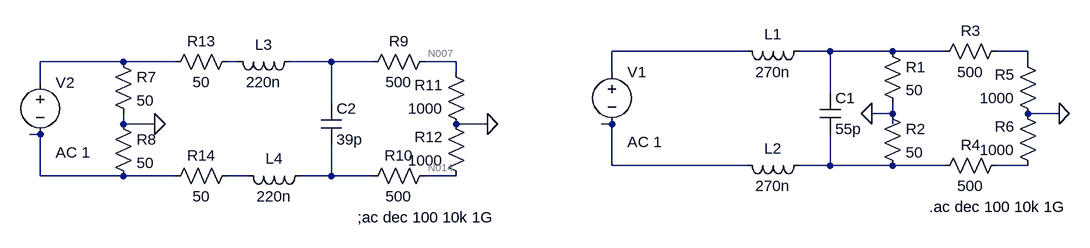
[diagram p0: schematic Filtre DAC.asc]
Filtre DAC.asc, the LTspice schematic file:
Version 4
SHEET 1 880 680
WIRE 304 112 96 112
WIRE 432 112 384 112
WIRE 528 112 432 112
WIRE 608 112 528 112
WIRE 736 112 688 112
WIRE -656 128 -784 128
WIRE -576 128 -656 128
WIRE -480 128 -496 128
WIRE -336 128 -400 128
WIRE -272 128 -336 128
WIRE -144 128 -192 128
WIRE 736 128 736 112
WIRE -144 144 -144 128
WIRE 96 144 96 112
WIRE -784 160 -784 128
WIRE 432 176 432 112
WIRE -336 192 -336 128
WIRE 528 208 528 192
WIRE 528 208 496 208
WIRE 784 208 736 208
WIRE -656 224 -656 208
WIRE -608 224 -656 224
WIRE -96 224 -144 224
WIRE 96 224 80 224
WIRE 528 224 528 208
WIRE -784 240 -800 240
WIRE 96 288 96 224
WIRE 304 288 96 288
WIRE 432 288 432 240
WIRE 432 288 384 288
WIRE 528 288 432 288
WIRE 608 288 528 288
WIRE 736 288 688 288
WIRE -784 304 -784 240
WIRE -656 304 -784 304
WIRE -576 304 -656 304
WIRE -464 304 -496 304
WIRE -336 304 -336 256
WIRE -336 304 -384 304
WIRE -272 304 -336 304
WIRE -144 304 -192 304
FLAG 496 208 0
FLAG 784 208 0
FLAG -96 224 0
FLAG -608 224 0
SYMBOL ind 400 96 R90
WINDOW 0 5 56 VBottom 2
WINDOW 3 32 56 VTop 2
SYMATTR InstName L1
SYMATTR Value 270n
SYMBOL cap 416 176 R0
SYMATTR InstName C1
SYMATTR Value 55p
SYMBOL ind 400 272 R90
WINDOW 0 5 56 VBottom 2
WINDOW 3 32 56 VTop 2
SYMATTR InstName L2
SYMATTR Value 270n
SYMBOL voltage 96 128 R0
WINDOW 123 24 124 Left 2
WINDOW 39 0 0 Left 0
SYMATTR Value2 AC 1
SYMATTR InstName V1
SYMATTR Value ""
SYMBOL res 512 96 R0
SYMATTR InstName R1
SYMATTR Value 50
SYMBOL res 512 192 R0
SYMATTR InstName R2
SYMATTR Value 50
SYMBOL res 704 96 R90
WINDOW 0 0 56 VBottom 2
WINDOW 3 32 56 VTop 2
SYMATTR InstName R3
SYMATTR Value 500
SYMBOL res 704 272 R90
WINDOW 0 0 56 VBottom 2
WINDOW 3 32 56 VTop 2
SYMATTR InstName R4
SYMATTR Value 500
SYMBOL res 752 224 R180
WINDOW 0 36 76 Left 2
WINDOW 3 36 40 Left 2
SYMATTR InstName R5
SYMATTR Value 1000
SYMBOL res 752 304 R180
WINDOW 0 36 76 Left 2
WINDOW 3 36 40 Left 2
SYMATTR InstName R6
SYMATTR Value 1000
SYMBOL ind -384 112 R90
WINDOW 0 5 56 VBottom 2
WINDOW 3 32 56 VTop 2
SYMATTR InstName L3
SYMATTR Value 220n
SYMBOL cap -352 192 R0
SYMATTR InstName C2
SYMATTR Value 39p
SYMBOL ind -368 288 R90
WINDOW 0 5 56 VBottom 2
WINDOW 3 32 56 VTop 2
SYMATTR InstName L4
SYMATTR Value 220n
SYMBOL voltage -784 144 R0
WINDOW 123 24 124 Left 2
WINDOW 39 0 0 Left 0
SYMATTR Value2 AC 1
SYMATTR InstName V2
SYMATTR Value ""
SYMBOL res -176 112 R90
WINDOW 0 0 56 VBottom 2
WINDOW 3 32 56 VTop 2
SYMATTR InstName R9
SYMATTR Value 500
SYMBOL res -176 288 R90
WINDOW 0 0 56 VBottom 2
WINDOW 3 32 56 VTop 2
SYMATTR InstName R10
SYMATTR Value 500
SYMBOL res -128 240 R180
WINDOW 0 36 76 Left 2
WINDOW 3 36 40 Left 2
SYMATTR InstName R11
SYMATTR Value 1000
SYMBOL res -128 320 R180
WINDOW 0 36 76 Left 2
WINDOW 3 36 40 Left 2
SYMATTR InstName R12
SYMATTR Value 1000
SYMBOL res -672 112 R0
SYMATTR InstName R7
SYMATTR Value 50
SYMBOL res -672 208 R0
SYMATTR InstName R8
SYMATTR Value 50
SYMBOL res -480 112 R90
WINDOW 0 0 56 VBottom 2
WINDOW 3 32 56 VTop 2
SYMATTR InstName R13
SYMATTR Value 50
SYMBOL res -480 288 R90
WINDOW 0 0 56 VBottom 2
WINDOW 3 32 56 VTop 2
SYMATTR InstName R14
SYMATTR Value 50
TEXT 584 352 Left 2 !.ac dec 100 10k 1G
TEXT -296 368 Left 2 !;ac dec 100 10k 1G

The netlist it stands for:
* Filtre DAC.asc
L1 N002 N001 270n
C1 N002 N010 55p
L2 N010 N008 270n
V1 N001 N008 AC 1
R1 N002 0 50
R2 0 N010 50
R3 N003 N002 500
R4 N011 N010 500
R5 0 N003 1000
R6 N011 0 1000
L3 N006 N005 220n
C2 N006 N013 39p
L4 N013 N012 220n
V2 N004 N009 AC 1
R9 N007 N006 500
R10 N014 N013 500
R11 0 N007 1000
R12 N014 0 1000
R7 N004 0 50
R8 0 N009 50
R13 N005 N004 50
R14 N012 N009 50
.ac dec 100 10k 1G
;ac dec 100 10k 1G
.backanno
.end

* Results of the author's LTspice run, read from the files saved beside the schematic
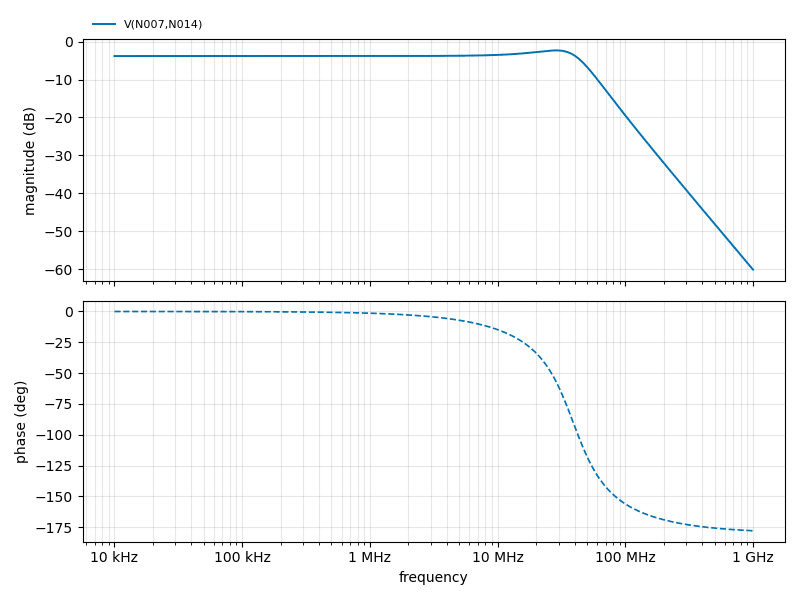
[diagram p1: AC Analysis of Filtre DAC.asc, plotted from the saved traces]
* AC Analysis, 1 run:
*   V(N007,N014): -3.81 dB at 10 kHz, -60.13 dB at 1 GHz, peak -2.32 dB at 28.84 MHz, 3 dB below the peak at 45.89 MHz